# EAGLE schematic interfaceB-robot (EAGLE 7.1.0)
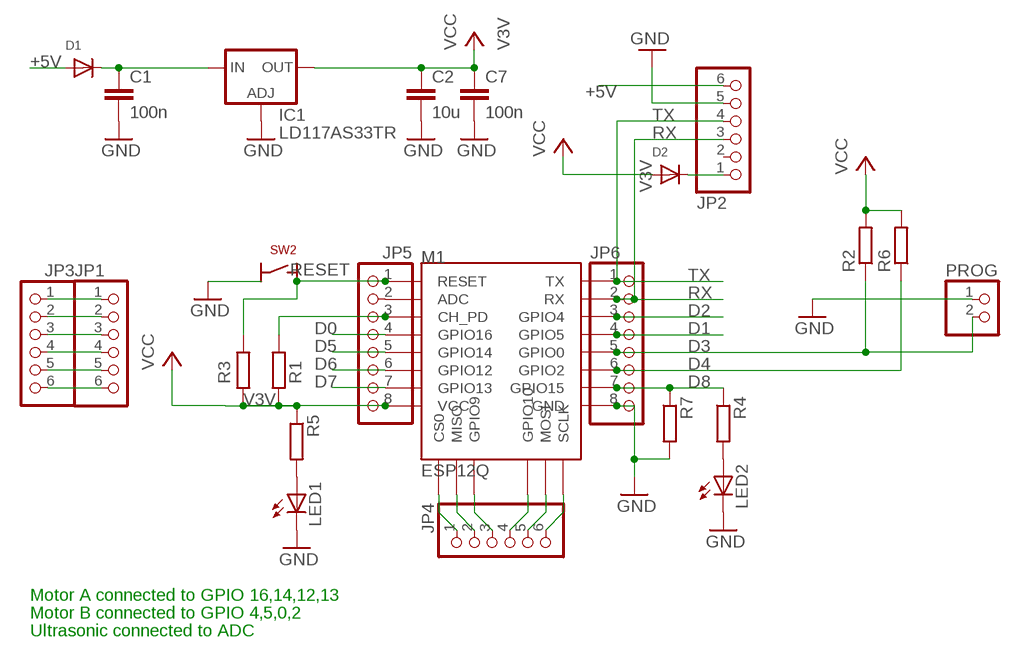
[diagram p0: schematic, sheet 1]

## Parts
C1  100n  C-EUC1206K  [C1206K]
C2  10u  C-EUC1206K  [C1206K]
C7  100n  C-EUC0805  [C0805]
D1  DIODE_SOD-123FL  [SOD-123FL]
D2  DIODE_SOD-123FL  [SOD-123FL]
IC1  LD117AS33TR  [SOT223]
JP1  PINHD-1X6  [1X06]
JP2  PINHD-1X6  [1X06]
JP3  PINHD-1X6  [1X06]
JP4  PINHD-1X6  [1X06]
JP5  PINHD-1X8  [1X08]
JP6  PINHD-1X8  [1X08]
LED1  LEDCHIPLED_0805  [CHIPLED_0805]
LED2  LEDCHIPLED_0805  [CHIPLED_0805]
M1  ESP12Q  [ESP12Q]
PROG  PINHD-1X2  [1X02]
R1  R-EU_R1206  [R1206]
R2  R-EU_R0805  [R0805]
R3  R-EU_R1206  [R1206]
R4  R-EU_R0805  [R0805]
R5  R-EU_R0805  [R0805]
R6  R-EU_R0805  [R0805]
R7  R-EU_R0805  [R0805]
SW2  SW4  [SW45-65]

## Nets
+5V: D1.A JP2.6
D0: JP5.4 M1.GPIO16
D1: JP6.4 M1.GPIO5
D2: JP6.3 M1.GPIO4
D3: JP6.5 M1.GPIO0 PROG.2 R2.1
D4: JP6.6 M1.GPIO2 R6.1
D5: JP5.5 M1.GPIO14
D6: JP5.6 M1.GPIO12
D7: JP5.7 M1.GPIO13
D8: JP6.7 M1.GPIO15 R4.1 R7.1
GND: C1.2 C2.2 C7.2 IC1.1(ADJ) JP2.5 JP6.8 LED1.C LED2.C M1.GND PROG.1 R7.2 SW2.4(P)
N$1: C1.1 D1.C IC1.3(IN)
N$2: JP5.2 M1.ADC
N$4: JP1.1 JP3.1
N$5: D2.C JP2.1
N$6: JP1.2 JP3.2
N$7: JP1.3 JP3.3
N$8: JP1.4 JP3.4
N$9: JP1.5 JP3.5
N$10: JP1.6 JP3.6
N$14: LED1.A R5.2
N$15: LED2.A R4.2
N$20: JP4.1 M1.CS0
N$21: JP4.2 M1.MISO
N$22: JP4.3 M1.GPIO9
N$23: JP4.4 M1.GPIO10
N$24: JP4.5 M1.MOSI
N$26: JP4.6 M1.SCLK
PD: JP5.3 M1.CH_PD R1.1
RESET: JP5.1 M1.RESET R3.1 SW2.2(S)
RX: JP2.3 JP6.2 M1.RX
TX: JP2.4 JP6.1 M1.TX
V3V: C2.1 C7.1 D2.A IC1.4(OUT) JP5.8 M1.VCC R1.2 R2.2 R3.2 R5.1 R6.2 ; supply symbol labelled VCC
Unconnected: JP2.2 SW2.1(S) SW2.3(P)

## Notes on the sheet
- Motor A connected to GPIO 16,14,12,13
- Motor B connected to GPIO 4,5,0,2
- Ultrasonic connected to ADC

## Library data of the parts
C1 C2 C7 = rcl:C-EU: CAPACITOR, European symbol
D1 D2 = adafruit:DIODE: Diode SMADIODE - SMA Surface Mount Package 20V 1A Schottky Diode Digikey: 641-1014-6-ND DO-1N4148 - Through Hole Small Current Diode SOD-123 20V 1 A (.5mV Vf) Schottky Diode - Digikey: MBRX120TPMSCT-ND SOD-323 10V 570mA (.38mV Vf, 3ns) Schottky Diode - Digikey: ZLLS410CT-ND SOD-523 30V 30mA Schottky Diode (RB751S-40TE61) - Digikey: RB751S-40TE61CT-ND SOT23-R/W - SOT23 Package (R = Solder Paste/Reflow Ovens, W = Hand-Soldering) BAT54Film 40V 300mA - Digikey: 497-7162-1-ND
IC1 = v-reg:LD117A?*: Low drop fixed and adjustable positive voltage regulators 1 A Source: http://www.st.com/stonline/products/literature/ds/7194/ld1117axx.pdf
JP1-JP4 = pinhead:PINHD-1X6: PIN HEADER
JP5 JP6 = pinhead:PINHD-1X8: PIN HEADER
LED1 LED2 = adafruit:LED: LED OSRAM: - CHIPLED LG R971, LG N971, LY N971, LG Q971, LY Q971, LO R971, LY R971 LH N974, LH R974 LS Q976, LO Q976, LY Q976 LO Q996 - Hyper CHIPLED LW Q18S LB Q993, LB Q99A, LB R99A - SideLED LS A670, LO A670, LY A670, LG A670, LP A670 LB A673, LV A673, LT A673, LW A673 LH A674 LY A675 LS A676, LA A676, LO A676, LY A676, LW A676 LS A679, LY A679, LG A679 - Hyper Micro SIDELED® LS Y876, LA Y876, LO Y876, LY Y876 LT Y87S - SmartLED LW L88C, LW L88S LB L89C, LB L89S, LG L890 LS L89K, LO L89K, LY L89K LS L896, LA L896, LO L896, LY L896 - TOPLED LS T670, LO T670, LY T670, LG T670, LP T670 LSG T670, LSP T670, LSY T670, LOP T670, LYG T670 LG T671, LOG T671, LSG T671 LB T673, LV T673, LT T673, LW T673 LH T674 LS T676, LA T676, LO T676, LY T676, LB T676, LH T676, LSB T676, LW T676 LB T67C, LV T67C, LT T67C, LS T67K, LO T67K, LY T67K, LW E67C LS E67B, LA E67B, LO E67B, LY E67B, LB E67C, LV E67C, LT E67C LW T67C LS T679, LY T679, LG T679 LS T770, LO T770, LY T770, LG T770, LP T770 LB T773, LV T773, LT T773, LW T773 LH T774 LS E675, LA E675, LY E675, LS T675 LS T776, LA T776, LO T776, LY T776, LB T776 LHGB T686 LT T68C, LB T68C - Hyper Mini TOPLED® LB M676 - Mini TOPLED Santana® LG M470 LS M47K, LO M47K, LY M47K Source: http://www.osram.convergy.de/
M1 = esp826612q:ESP12Q: ESP8266 Wifi module 12-Q
PROG = pinhead:PINHD-1X2: PIN HEADER
R1-R7 = rcl:R-EU_: RESISTOR, European symbol
SW2 = rolf_lib1:SW4